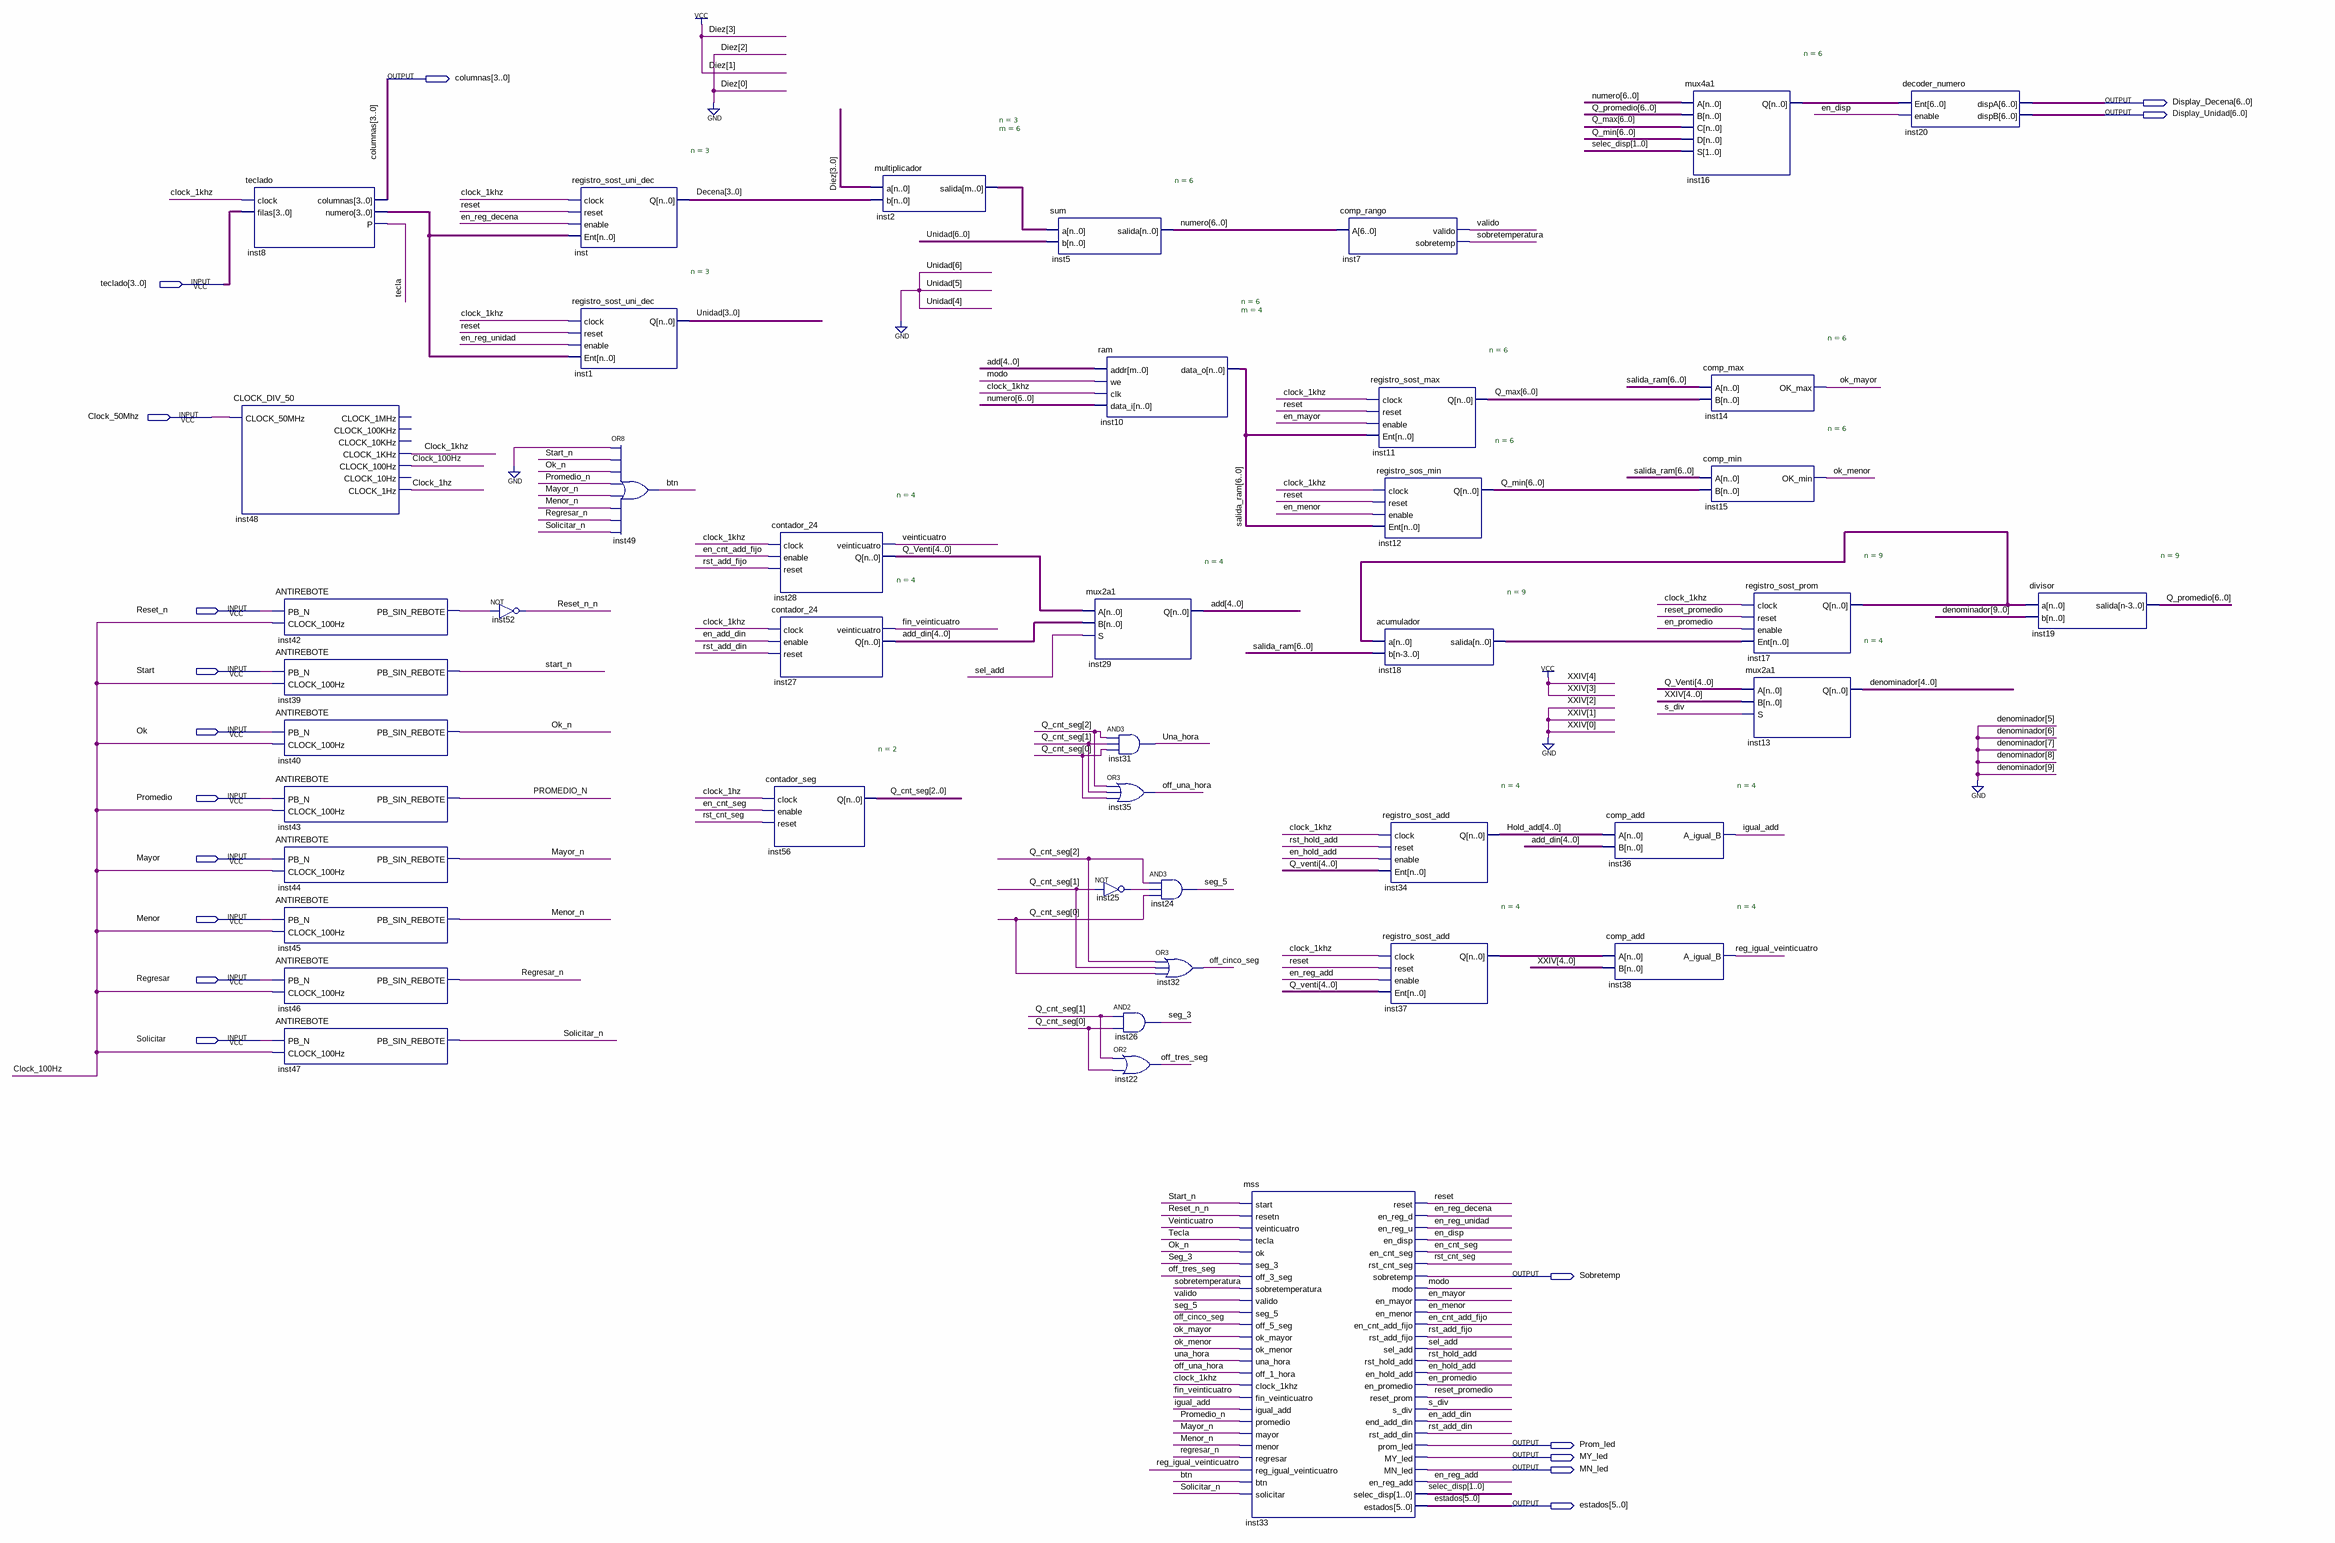
[diagram p0: schematic sheet]
// Quartus schematic PROYECTO.bdf as structural Verilog: 44 symbols, 18 pins
module PROYECTO (
  input  [3:0] teclado,
  input  Clock_50Mhz,
  input  Reset_n,
  input  Start,
  input  Ok,
  input  Promedio,
  input  Mayor,
  input  Menor,
  input  Regresar,
  input  Solicitar,
  output [3:0] columnas,
  output [6:0] Display_Decena,
  output [6:0] Display_Unidad,
  output Sobretemp,
  output Prom_led,
  output MY_led,
  output MN_led,
  output [5:0] estados
);

  wire btn, clock_1hz, clock_1khz, Clock_100Hz, en_add_din, en_cnt_add_fijo, en_cnt_seg, en_disp,
       en_hold_add, en_mayor, en_menor, en_promedio, en_reg_add, en_reg_decena, en_reg_unidad,
       fin_veinticuatro, igual_add, inst25_out, inst42_pb_sin_rebote, Mayor_n, Menor_n, modo, off_cinco_seg,
       off_tres_seg, off_una_hora, ok_mayor, ok_menor, Ok_n, Promedio_n, reg_igual_veinticuatro, Regresar_n,
       reset, Reset_n_n, reset_promedio, rst_add_din, rst_add_fijo, rst_cnt_seg, rst_hold_add, s_div, seg_3,
       seg_5, sel_add, sobretemperatura, Solicitar_n, Start_n, Tecla, Una_hora, valido, veinticuatro;
  wire [1:0] selec_disp;
  wire [2:0] Q_cnt_seg;
  wire [3:0] Decena, inst8_numero, Unidad;
  wire [4:0] add, add_din, denominador, Hold_add, inst37_q, Q_Venti;
  wire [6:0] inst2_salida, inst16_q, numero, Q_max, Q_min, Q_promedio, salida_ram;
  wire [9:0] inst17_q, inst18_salida;

  teclado inst8 (.clock(clock_1khz), .filas(teclado), .columnas(columnas), .numero(inst8_numero), .P(Tecla));
  CLOCK_DIV_50 inst48 (
    .CLOCK_50MHz(Clock_50Mhz), .CLOCK_1KHz(clock_1khz), .CLOCK_100Hz(Clock_100Hz), .CLOCK_1Hz(clock_1hz));  // open: CLOCK_1MHz, CLOCK_100KHz, CLOCK_10KHz, CLOCK_10Hz
  ANTIREBOTE inst42 (.PB_N(Reset_n), .CLOCK_100Hz(Clock_100Hz), .PB_SIN_REBOTE(inst42_pb_sin_rebote));
  ANTIREBOTE inst39 (.PB_N(Start), .CLOCK_100Hz(Clock_100Hz), .PB_SIN_REBOTE(Start_n));
  ANTIREBOTE inst40 (.PB_N(Ok), .CLOCK_100Hz(Clock_100Hz), .PB_SIN_REBOTE(Ok_n));
  ANTIREBOTE inst43 (.PB_N(Promedio), .CLOCK_100Hz(Clock_100Hz), .PB_SIN_REBOTE(Promedio_n));
  ANTIREBOTE inst44 (.PB_N(Mayor), .CLOCK_100Hz(Clock_100Hz), .PB_SIN_REBOTE(Mayor_n));
  ANTIREBOTE inst45 (.PB_N(Menor), .CLOCK_100Hz(Clock_100Hz), .PB_SIN_REBOTE(Menor_n));
  ANTIREBOTE inst46 (.PB_N(Regresar), .CLOCK_100Hz(Clock_100Hz), .PB_SIN_REBOTE(Regresar_n));
  ANTIREBOTE inst47 (.PB_N(Solicitar), .CLOCK_100Hz(Clock_100Hz), .PB_SIN_REBOTE(Solicitar_n));
  not inst52 (Reset_n_n, inst42_pb_sin_rebote);
  registro_sost_uni_dec #(.n(3)) inst (
    .clock(clock_1khz), .reset(reset), .enable(en_reg_decena), .Ent(inst8_numero), .Q(Decena));
  registro_sost_uni_dec #(.n(3)) inst1 (
    .clock(clock_1khz), .reset(reset), .enable(en_reg_unidad), .Ent(inst8_numero), .Q(Unidad));
  or inst49 (btn, 1'b0, Start_n, Ok_n, Promedio_n, Mayor_n, Menor_n, Regresar_n, Solicitar_n);
  contador_24 #(.n(4)) inst28 (
    .clock(clock_1khz), .enable(en_cnt_add_fijo), .reset(rst_add_fijo), .veinticuatro(veinticuatro),
    .Q(Q_Venti));
  contador_24 #(.n(4)) inst27 (
    .clock(clock_1khz), .enable(en_add_din), .reset(rst_add_din), .veinticuatro(fin_veinticuatro), .Q(add_din));
  contador_seg #(.n(2)) inst56 (.clock(clock_1hz), .enable(en_cnt_seg), .reset(rst_cnt_seg), .Q(Q_cnt_seg));
  multiplicador #(.n(3), .m(6)) inst2 (.a(4'b1010), .b(Decena), .salida(inst2_salida));
  sum #(.n(6)) inst5 (.a(inst2_salida), .b({3'b000, Unidad}), .salida(numero));
  ram #(.n(6), .m(4)) inst10 (.addr(add), .we(modo), .clk(clock_1khz), .data_i(numero), .data_o(salida_ram));
  mux2a1 #(.n(4)) inst29 (.A(Q_Venti), .B(add_din), .S(sel_add), .Q(add));
  and inst31 (Una_hora, Q_cnt_seg[2], Q_cnt_seg[1], Q_cnt_seg[0]);
  or inst35 (off_una_hora, Q_cnt_seg[2], Q_cnt_seg[1], Q_cnt_seg[0]);
  not inst25 (inst25_out, Q_cnt_seg[1]);
  and inst26 (seg_3, Q_cnt_seg[1], Q_cnt_seg[0]);
  or inst22 (off_tres_seg, Q_cnt_seg[1], Q_cnt_seg[0]);
  and inst24 (seg_5, Q_cnt_seg[2], inst25_out, Q_cnt_seg[0]);
  or inst32 (off_cinco_seg, Q_cnt_seg[2], Q_cnt_seg[1], Q_cnt_seg[0]);
  mss inst33 (
    .start(Start_n), .resetn(Reset_n_n), .veinticuatro(veinticuatro), .tecla(Tecla), .ok(Ok_n),
    .seg_3(seg_3), .off_3_seg(off_tres_seg), .sobretemperatura(sobretemperatura), .valido(valido),
    .seg_5(seg_5), .off_5_seg(off_cinco_seg), .ok_mayor(ok_mayor), .ok_menor(ok_menor), .una_hora(Una_hora),
    .off_1_hora(off_una_hora), .clock_1khz(clock_1khz), .fin_veinticuatro(fin_veinticuatro),
    .igual_add(igual_add), .promedio(Promedio_n), .mayor(Mayor_n), .menor(Menor_n), .regresar(Regresar_n),
    .reg_igual_veinticuatro(reg_igual_veinticuatro), .btn(btn), .solicitar(Solicitar_n), .reset(reset),
    .en_reg_d(en_reg_decena), .en_reg_u(en_reg_unidad), .en_disp(en_disp), .en_cnt_seg(en_cnt_seg),
    .rst_cnt_seg(rst_cnt_seg), .sobretemp(Sobretemp), .modo(modo), .en_mayor(en_mayor), .en_menor(en_menor),
    .en_cnt_add_fijo(en_cnt_add_fijo), .rst_add_fijo(rst_add_fijo), .sel_add(sel_add),
    .rst_hold_add(rst_hold_add), .en_hold_add(en_hold_add), .en_promedio(en_promedio),
    .reset_prom(reset_promedio), .s_div(s_div), .end_add_din(en_add_din), .rst_add_din(rst_add_din),
    .prom_led(Prom_led), .MY_led(MY_led), .MN_led(MN_led), .en_reg_add(en_reg_add), .selec_disp(selec_disp),
    .estados(estados));
  comp_rango inst7 (.A(numero), .valido(valido), .sobretemp(sobretemperatura));
  registro_sost_max #(.n(6)) inst11 (.clock(clock_1khz), .reset(reset), .enable(en_mayor), .Ent(salida_ram), .Q(Q_max));
  registro_sos_min #(.n(6)) inst12 (.clock(clock_1khz), .reset(reset), .enable(en_menor), .Ent(salida_ram), .Q(Q_min));
  acumulador #(.n(9)) inst18 (.a(inst17_q), .b(salida_ram), .salida(inst18_salida));
  registro_sost_add #(.n(4)) inst34 (
    .clock(clock_1khz), .reset(rst_hold_add), .enable(en_hold_add), .Ent(Q_Venti), .Q(Hold_add));
  registro_sost_add #(.n(4)) inst37 (
    .clock(clock_1khz), .reset(reset), .enable(en_reg_add), .Ent(Q_Venti), .Q(inst37_q));
  comp_add #(.n(4)) inst36 (.A(Hold_add), .B(add_din), .A_igual_B(igual_add));
  comp_add #(.n(4)) inst38 (.A(inst37_q), .B(5'b11000), .A_igual_B(reg_igual_veinticuatro));
  mux4a1 #(.n(6)) inst16 (.A(numero), .B(Q_promedio), .C(Q_max), .D(Q_min), .S(selec_disp), .Q(inst16_q));
  comp_max #(.n(6)) inst14 (.A(salida_ram), .B(Q_max), .OK_max(ok_mayor));
  comp_min #(.n(6)) inst15 (.A(salida_ram), .B(Q_min), .OK_min(ok_menor));
  registro_sost_prom #(.n(9)) inst17 (
    .clock(clock_1khz), .reset(reset_promedio), .enable(en_promedio), .Ent(inst18_salida), .Q(inst17_q));
  mux2a1 #(.n(4)) inst13 (.A(Q_Venti), .B(5'b11000), .S(s_div), .Q(denominador));
  decoder_numero inst20 (.Ent(inst16_q), .enable(en_disp), .dispA(Display_Decena), .dispB(Display_Unidad));
  divisor #(.n(9)) inst19 (.a(inst17_q), .b({{5{1'b0}}, denominador}), .salida(Q_promedio));
endmodule
